# EAGLE board brains (EAGLE 5.11), part 1 of 3
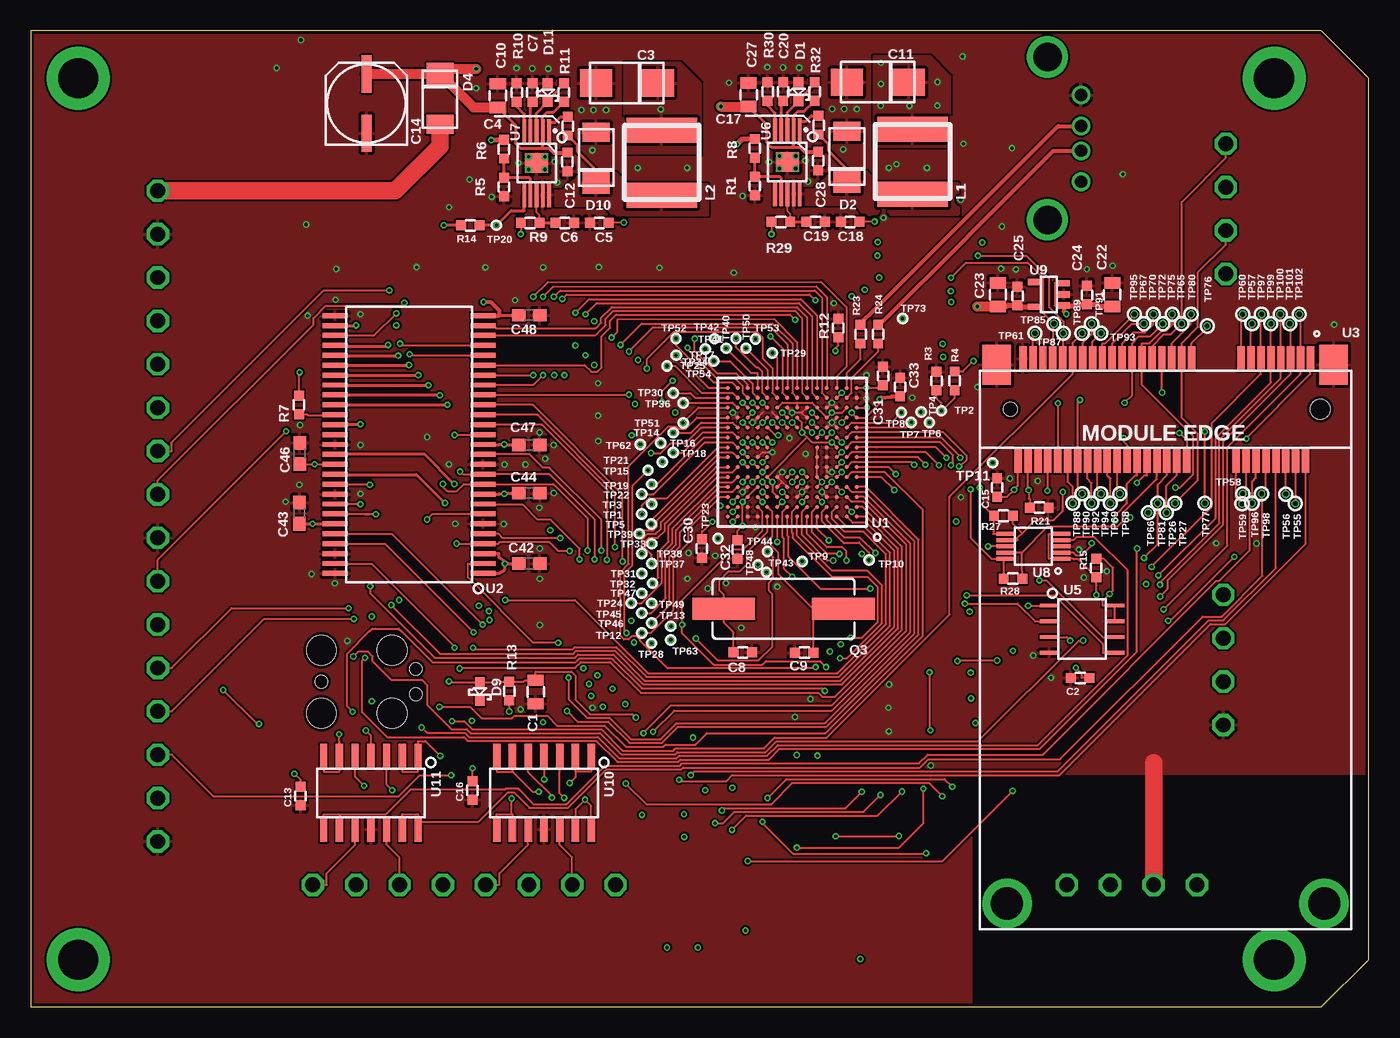
[diagram p6: board, top side]
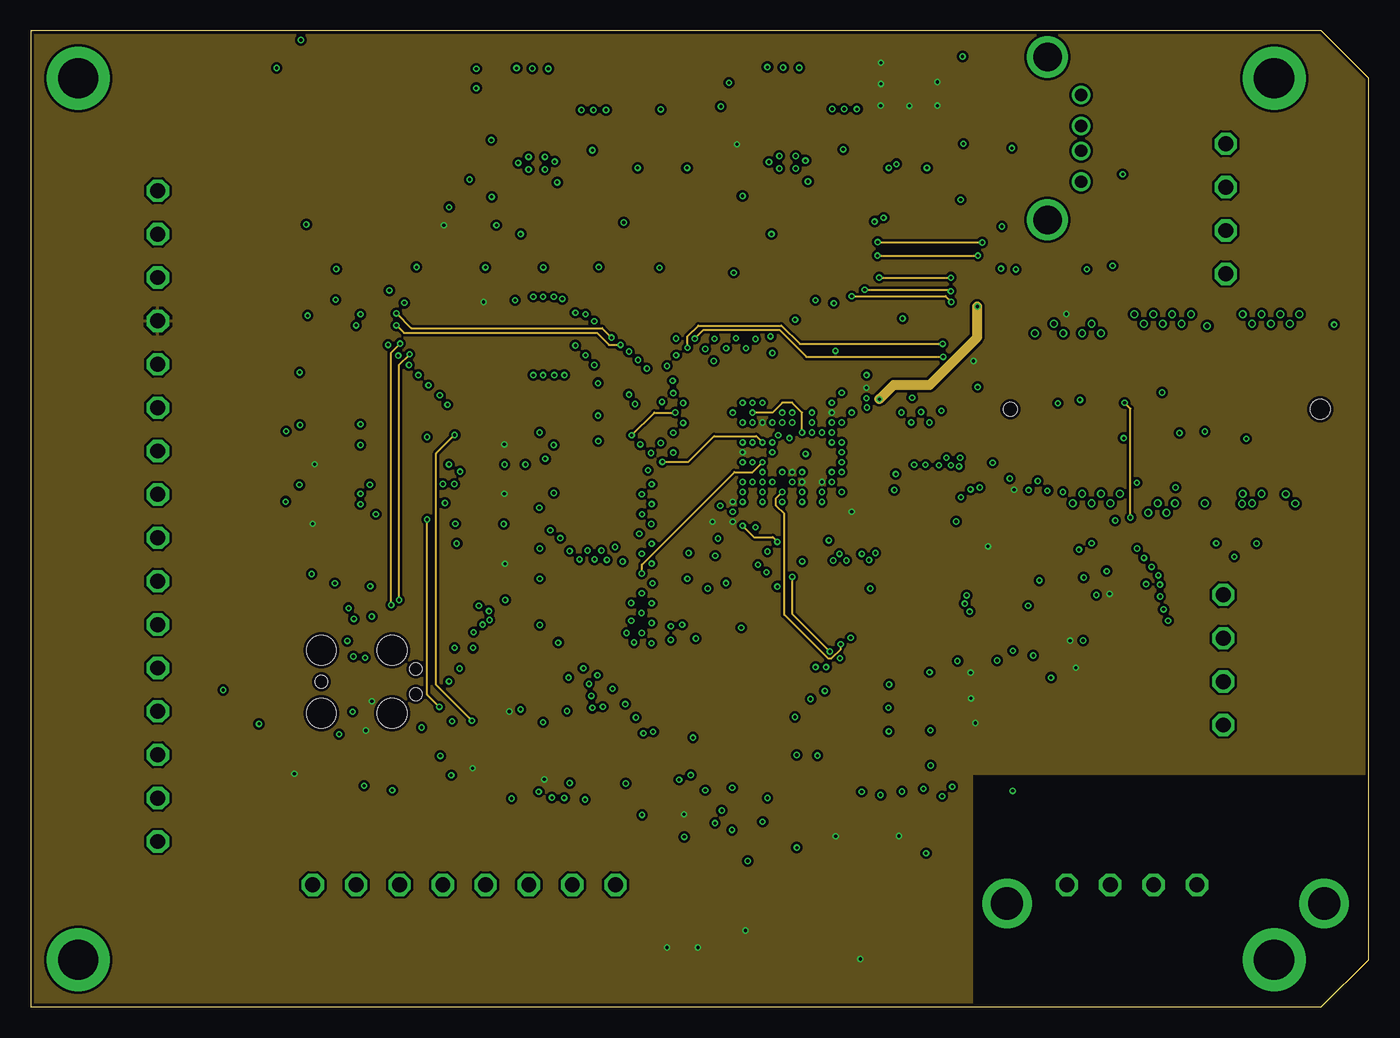
[diagram p7: board, inner layer Route2]
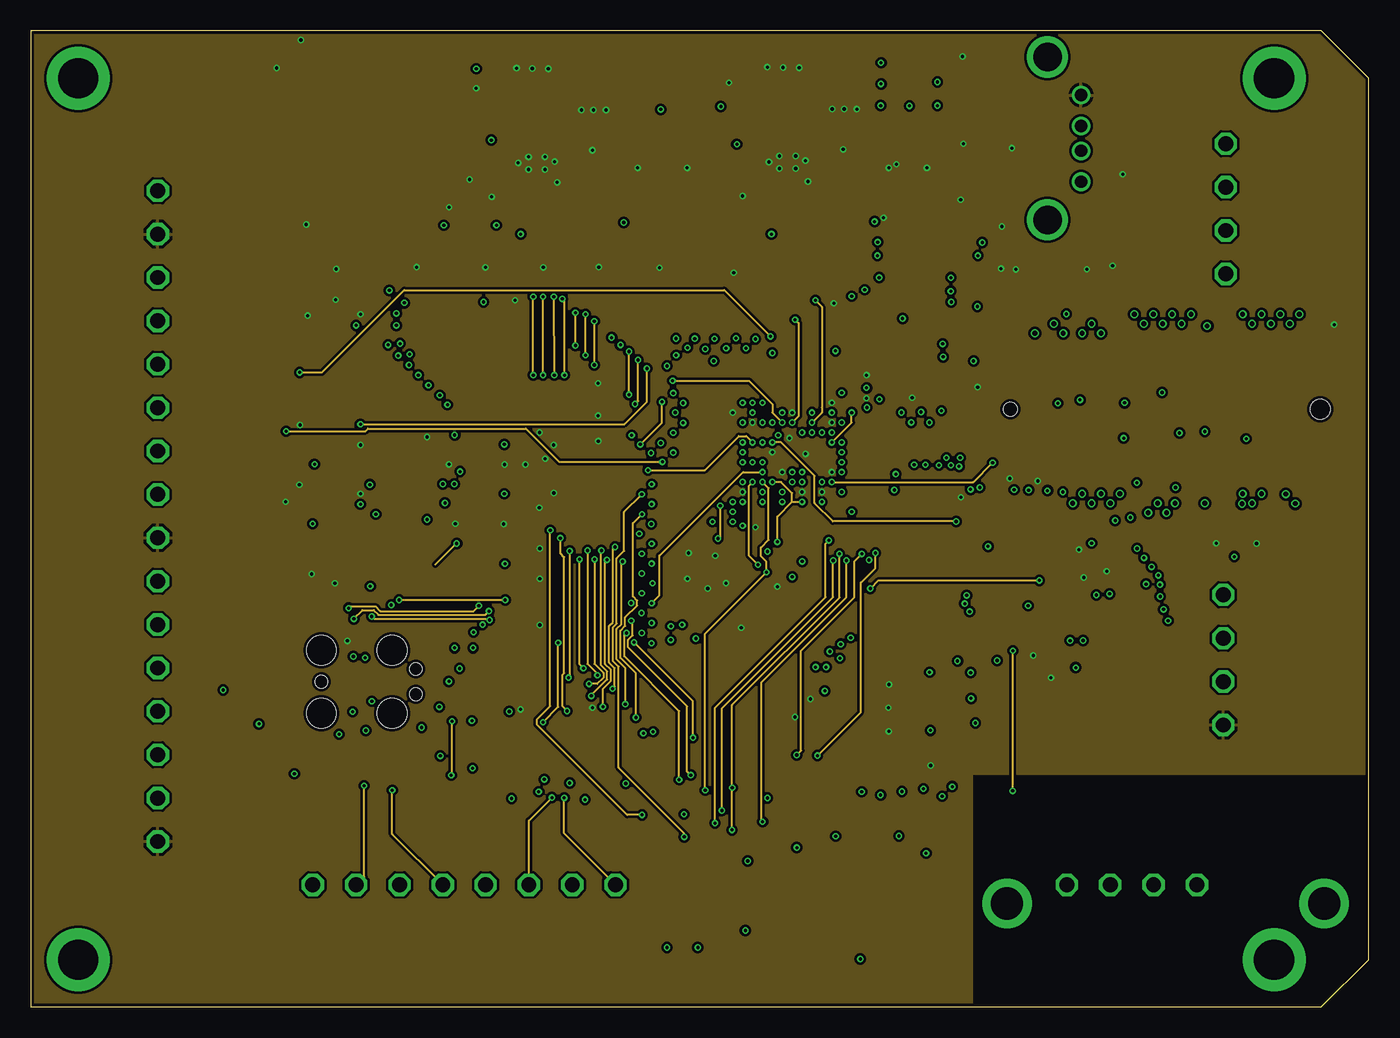
[diagram p8: board, inner layer Route3]
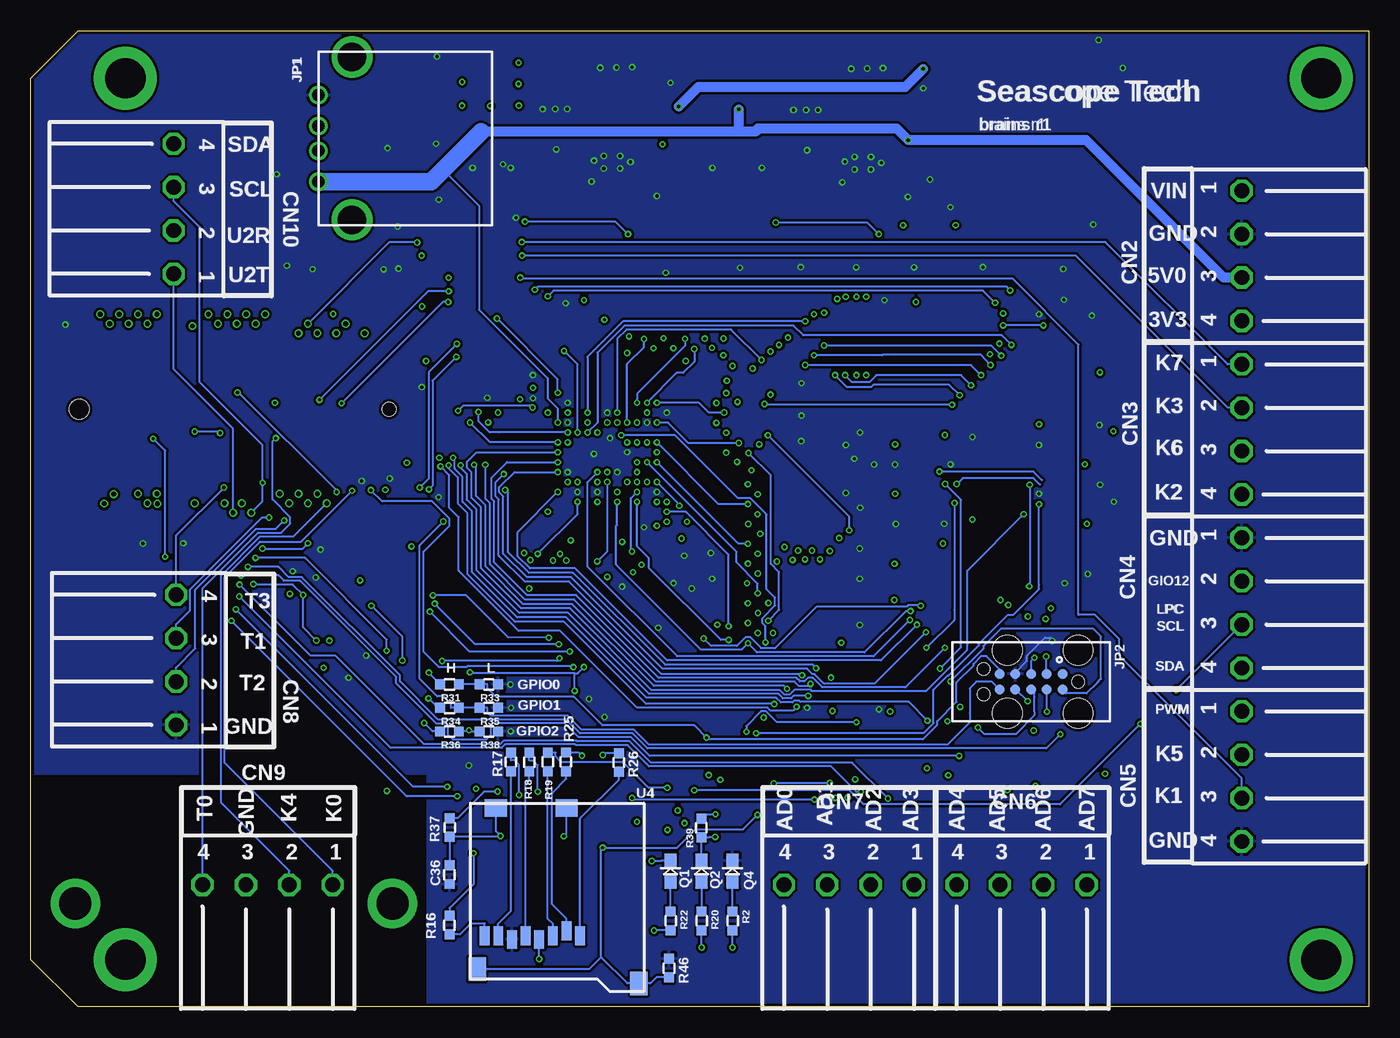
[diagram p9: board, bottom side, seen from below]

Size 107.95 x 78.74 mm. Coordinates in mm from the lower left corner, seen from the top.
Outline: 0,78.74 0,0
Copper layers (1+2*3+16): Top 0.0356mm / dielectric 0.2794mm / Route2 0.0356mm / dielectric 0.9906mm / Route3 0.0356mm / dielectric 0.2794mm / Bottom 0.0356mm
Design rules "66each-compact *": minimum track width 6mil, minimum drill 10mil, track to track 6mil, track to pad 6mil, pad to pad 6mil, via to via 6mil, smd to smd 6mil, copper to edge 10mil, drill to drill 10mil, minimum pad ring 5mil, minimum via ring 5mil, stop-mask expansion 2.5mil, vias tented up to drill 15mil, thermal gap 10mil
Net classes: 2 rf: clearance 0.635 mm; 3 usb: clearance 0.762 mm

## Footprints (pad centres in the part's own frame; a part is rotated, then mirrored left to right if it is on the bottom)
SMD0805 = smd 0.9 x 1.3: 1 -0.95,0; 2 0.95,0
SMD0603 = smd 0.8 x 0.8: 1 -0.75,0; 2 0.75,0
CT6032 = smd 2.6 x 2.2: + 2.5,0; - -2.5,0
PANASONIC-ELEC-D8 = smd 3 x 0.8: + 2.4,0; - -2.4,0
C0603 = smd 1.1 x 1: 1 -0.85,0; 2 0.85,0
1X4-3.5MM = drill 1.2 octagon: 1 0,0; 2 0,-3.5; 3 0,-7; 4 0,-10.5
0603-SCHOTTKY = smd 0.8 x 0.8: A -0.75,0; K 0.75,0
DO-214-AC(SMA) = smd 1.52 x 2.18: A 2.032,0 | smd 1.778 x 2.159: C -2.032,0
FORMFACTOR = drill 3.251 pad 5.08 round: S1 3.81,3.81; S2 100.33,3.81; S3 100.33,74.93; S4 3.81,74.93
UE27AC = drill 1 round: 1 -3.5,0; 2 -1,0; 3 1,0; 4 3.5,0 | drill 2.3 round: S1 -6.57,-2.71; S2 6.57,-2.71
TC2050-IDC = smd 0.8 x 0.8: 1 -2.54,-0.635; 2 -2.54,0.635; 3 -1.27,-0.635; 4 -1.27,0.635; 5 0,-0.635; 6 0,0.635; 7 1.27,-0.635; 8 1.27,0.635; 9 2.54,-0.635; 10 2.54,0.635 | hole 1: -3.81,0; 3.81,1.016; 3.81,-1.016 | hole 2.375: -3.81,2.54; -3.81,-2.54; 1.905,2.54; 1.905,-2.54
NR60 = smd 2 x 5.7: 1 -2.65,0; 2 2.6,0
LED0603 = smd 1.1 x 1: A -0.85,0; C 0.85,0
SM49 = smd 5.08 x 1.778: 1 -4.826,0; 2 4.826,0
10MIL = drill 0.254 pad 0.508 round: 1 0,0
15MIL = drill 0.381 round: 1 0,0
SOT570-3 = smd 0.31 x 0.31: A1 -5.2,5.2; A2 -4.4,5.2; A3 -3.6,5.2; A4 -2.8,5.2; A5 -2,5.2; A6 -1.2,5.2; A7 -0.4,5.2; A8 0.4,5.2; A9 1.2,5.2; A10 2,5.2; A11 2.8,5.2; A12 3.6,5.2; A13 4.4,5.2; A14 5.2,5.2; B1 -5.2,4.4; B2 -4.4,4.4; B3 -3.6,4.4; B4 -2.8,4.4; B5 -2,4.4; B6 -1.2,4.4; B7 -0.4,4.4; B8 0.4,4.4; B9 1.2,4.4; B10 2,4.4; B11 2.8,4.4; B12 3.6,4.4; B13 4.4,4.4; B14 5.2,4.4; C1 -5.2,3.6; C2 -4.4,3.6; C3 -3.6,3.6; C4 -2.8,3.6; C5 -2,3.6; C6 -1.2,3.6; C7 -0.4,3.6; C8 0.4,3.6; C9 1.2,3.6; C10 2,3.6; C11 2.8,3.6; C12 3.6,3.6; C13 4.4,3.6; C14 5.2,3.6; D1 -5.2,2.8; D2 -4.4,2.8; D3 -3.6,2.8; D4 -2.8,2.8; D5 -2,2.8; D6 -1.2,2.8; D7 -0.4,2.8; D8 0.4,2.8; D9 1.2,2.8; D10 2,2.8; D11 2.8,2.8; D12 3.6,2.8; D13 4.4,2.8; D14 5.2,2.8; E1 -5.2,2; E2 -4.4,2; E3 -3.6,2; E4 -2.8,2; E5 -2,2; E6 -1.2,2; E7 -0.4,2; E8 0.4,2; E9 1.2,2; E10 2,2; E11 2.8,2; E12 3.6,2; E13 4.4,2; E14 5.2,2; F1 -5.2,1.2; F2 -4.4,1.2; F3 -3.6,1.2; F4 -2.8,1.2; F5 -2,1.2; F10 2,1.2; F11 2.8,1.2; F12 3.6,1.2; F13 4.4,1.2; F14 5.2,1.2; G1 -5.2,0.4; G2 -4.4,0.4; G3 -3.6,0.4; G4 -2.8,0.4; G5 -2,0.4; G10 2,0.4; G11 2.8,0.4; G12 3.6,0.4; G13 4.4,0.4; G14 5.2,0.4; H1 -5.2,-0.4; H2 -4.4,-0.4; H3 -3.6,-0.4; H4 -2.8,-0.4; H5 -2,-0.4; H10 2,-0.4; H11 2.8,-0.4; H12 3.6,-0.4; H13 4.4,-0.4; H14 5.2,-0.4; J1 -5.2,-1.2; J2 -4.4,-1.2; J3 -3.6,-1.2; J4 -2.8,-1.2; J5 -2,-1.2; J10 2,-1.2; J11 2.8,-1.2; J12 3.6,-1.2; J13 4.4,-1.2; J14 5.2,-1.2; K1 -5.2,-2; K2 -4.4,-2; K3 -3.6,-2; K4 -2.8,-2; K5 -2,-2; K6 -1.2,-2; K7 -0.4,-2; K8 0.4,-2; K9 1.2,-2; K10 2,-2; K11 2.8,-2; K12 3.6,-2; K13 4.4,-2; K14 5.2,-2; L1 -5.2,-2.8; L2 -4.4,-2.8; L3 -3.6,-2.8; L4 -2.8,-2.8; L5 -2,-2.8; L6 -1.2,-2.8; L7 -0.4,-2.8; L8 0.4,-2.8; L9 1.2,-2.8; L10 2,-2.8; L11 2.8,-2.8; L12 3.6,-2.8; L13 4.4,-2.8; L14 5.2,-2.8; M1 -5.2,-3.6; M2 -4.4,-3.6; M3 -3.6,-3.6; M4 -2.8,-3.6; M5 -2,-3.6; M6 -1.2,-3.6; M7 -0.4,-3.6; M8 0.4,-3.6; M9 1.2,-3.6; M10 2,-3.6; M11 2.8,-3.6; M12 3.6,-3.6; M13 4.4,-3.6; M14 5.2,-3.6; N1 -5.2,-4.4; N2 -4.4,-4.4; N3 -3.6,-4.4; N4 -2.8,-4.4; N5 -2,-4.4; N6 -1.2,-4.4; N7 -0.4,-4.4; N8 0.4,-4.4; N9 1.2,-4.4; N10 2,-4.4; N11 2.8,-4.4; N12 3.6,-4.4; N13 4.4,-4.4; N14 5.2,-4.4; P1 -5.2,-5.2; P2 -4.4,-5.2; P3 -3.6,-5.2; P4 -2.8,-5.2; P5 -2,-5.2; P6 -1.2,-5.2; P7 -0.4,-5.2; P8 0.4,-5.2; P9 1.2,-5.2; P10 2,-5.2; P11 2.8,-5.2; P12 3.6,-5.2; P13 4.4,-5.2; P14 5.2,-5.2
TSSOP-54 = smd 2 x 0.4: 1 -5.98,10.4; 2 -5.98,9.6; 3 -5.98,8.8; 4 -5.98,8; 5 -5.98,7.2; 6 -5.98,6.4; 7 -5.98,5.6; 8 -5.98,4.8; 9 -5.98,4; 10 -5.98,3.2; 11 -5.98,2.4; 12 -5.98,1.6; 13 -5.98,0.8; 14 -5.98,0; 15 -5.98,-0.8; 16 -5.98,-1.6; 17 -5.98,-2.4; 18 -5.98,-3.2; 19 -5.98,-4; 20 -5.98,-4.8; 21 -5.98,-5.6; 22 -5.98,-6.4; 23 -5.98,-7.2; 24 -5.98,-8; 25 -5.98,-8.8; 26 -5.98,-9.6; 27 -5.98,-10.4; 28 5.98,-10.4; 29 5.98,-9.6; 30 5.98,-8.8; 31 5.98,-8; 32 5.98,-7.2; 33 5.98,-6.4; 34 5.98,-5.6; 35 5.98,-4.8; 36 5.98,-4; 37 5.98,-3.2; 38 5.98,-2.4; 39 5.98,-1.6; 40 5.98,-0.8; 41 5.98,0; 42 5.98,0.8; 43 5.98,1.6; 44 5.98,2.4; 45 5.98,3.2; 46 5.98,4; 47 5.98,4.8; 48 5.98,5.6; 49 5.98,6.4; 50 5.98,7.2; 51 5.98,8; 52 5.98,8.8; 53 5.98,9.6; 54 5.98,10.4
MINI-MODULE = smd 0.6 x 2: 1 -11.6,-4.1; 2 -11.2,4.1; 3 -10.8,-4.1; 4 -10.4,4.1; 5 -10,-4.1; 6 -9.6,4.1; 7 -9.2,-4.1; 8 -8.8,4.1; 9 -8.4,-4.1; 10 -8,4.1; 11 -7.6,-4.1; 12 -7.2,4.1; 13 -6.8,-4.1; 14 -6.4,4.1; 15 -6,-4.1; 16 -5.6,4.1; 17 -2,-4.1; 18 -1.6,4.1; 19 -1.2,-4.1; 20 -0.8,4.1; 21 -0.4,-4.1; 22 0,4.1; 23 0.4,-4.1; 24 0.8,4.1; 25 1.2,-4.1; 26 1.6,4.1; 27 2,-4.1; 28 2.4,4.1; 29 2.8,-4.1; 30 3.2,4.1; 31 3.6,-4.1; 32 4,4.1; 33 4.4,-4.1; 34 4.8,4.1; 35 5.2,-4.1; 36 5.6,4.1; 37 6,-4.1; 38 6.4,4.1; 39 6.8,-4.1; 40 7.2,4.1; 41 7.6,-4.1; 42 8,4.1; 43 8.4,-4.1; 44 8.8,4.1; 45 9.2,-4.1; 46 9.6,4.1; 47 10,-4.1; 48 10.4,4.1; 49 10.8,-4.1; 50 11.2,4.1; 51 11.6,-4.1; 52 12,4.1 | drill 2.6 pad 4 round: 53 -12.7,39.862; 54 12.9,39.862 | smd 2.3 x 3.2: S1 -13.473,-3.6; S2 13.727,-3.6 | hole 1.1: 12.627,0 | hole 1.6: -12.373,0
SD-MICRO-101-00581-59 = smd 0.8 x 1.5: 1 0,0; 2 1.1,-0.4; 3 2.2,0; 4 3.3,0.3; 5 4.4,0; 6 5.5,0.3; 7 6.6,0; 8 7.7,0 | smd 1.8 x 1.4: 10-1 1.1,-10.3; 10-2 6.8,-10.3 | smd 1.4 x 1.9: S1 8.3,2.7; S2 -4.75,3.85
M25-SO8 = smd 1.5 x 0.3: 1 -2.65,1.905; 2 -2.65,0.635; 3 -2.65,-0.635; 4 -2.65,-1.905; 5 2.65,-1.905; 6 2.65,-0.635; 7 2.65,0.635; 8 2.65,1.905
POWERPAD-10 = smd 2 x 0.3: 1 -2.55,1; 2 -2.55,0.5; 3 -2.55,0; 4 -2.55,-0.5; 5 -2.55,-1; 6 2.55,-1; 7 2.55,-0.5; 8 2.55,0; 9 2.55,0.5; 10 2.55,1 | smd 1.57 x 1.88: 11 0,0
MSOP-10 = smd 1.5 x 0.32: 1 -2.25,1; 2 -2.25,0.5; 3 -2.25,0; 4 -2.25,-0.5; 5 -2.25,-1; 6 2.25,-1; 7 2.25,-0.5; 8 2.25,0; 9 2.25,0.5; 10 2.25,1
SOT-23-5 = smd 0.5 x 1: 1 0.9,1.3; 2 0,1.3; 3 -0.9,1.3; 4 -1,-1.1; 5 1,-1.1
SOIC-14 = smd 2 x 0.6: 1 -2.95,3.81; 2 -2.95,2.54; 3 -2.95,1.27; 4 -2.95,0; 5 -2.95,-1.27; 6 -2.95,-2.54; 7 -2.95,-3.81; 8 2.95,-3.81; 9 2.95,-2.54; 10 2.95,-1.27; 11 2.95,0; 12 2.95,1.27; 13 2.95,2.54; 14 2.95,3.81

## Placement (x,y rotation side)
C1  [SMD0805]  40.74,25.41 90 top
C2  [SMD0603]  84.68,26.54 0 top
C3  [CT6032]  48.11,74.54 0 top
C4  [SMD0603]  43.32,71.06 270 top
C5  [SMD0603]  45.87,63.26 180 top
C6  [SMD0603]  43.08,63.26 180 top
C7  [SMD0603]  40.47,73.77 270 top
C8  [SMD0603]  57.45,28.62 180 top
C9  [SMD0603]  62.42,28.59 0 top
C10  [SMD0805]  37.68,73.52 270 top
C11  [CT6032]  68.35,74.61 0 top
C12  [SMD0603]  43.29,68.19 90 top
C13  [SMD0603]  21.77,17.02 90 top
C14  [PANASONIC-ELEC-D8]  27.08,72.88 90 top
C15  [SMD0603]  77.98,41.91 270 top
C16  [SMD0603]  35.64,17.48 90 top
C17  [SMD0603]  63.57,71.14 270 top
C18  [SMD0603]  66.12,63.34 180 top
C19  [SMD0603]  63.32,63.34 180 top
C20  [SMD0603]  60.71,73.85 270 top
C22  [SMD0805]  87.26,57.46 270 top
C23  [SMD0805]  78.04,57.46 270 top
C24  [SMD0603]  85.22,57.44 270 top
C25  [SMD0603]  79.61,57.36 270 top
C27  [SMD0805]  57.92,73.6 270 top
C28  [SMD0603]  63.53,68.26 90 top
C30  0.1u  [SMD0603]  54.16,36.99 90 top
C31  0.1u  [SMD0603]  68.76,50.91 270 top
C32  0.1u  [SMD0603]  57.04,36.91 90 top
C33  0.1u  [SMD0603]  70.15,50.01 270 top
C36  0.1u  [SMD0603]  74.17,10.67 90 bottom
C42  0.1u  [C0603]  40.21,35.78 0 top
C43  0.1u  [C0603]  21.67,39.84 90 top
C44  0.1u  [C0603]  40.22,41.45 0 top
C46  0.1u  [C0603]  21.69,44.65 90 top
C47  0.1u  [C0603]  40.21,45.34 0 top
C48  0.1u  [C0603]  40.21,55.8 0 top
CN2  CONN-4  [1X4-3.5MM]  10.24,65.85 0 bottom
CN3  CONN-4  [1X4-3.5MM]  10.24,51.85 0 bottom
CN4  CONN-4  [1X4-3.5MM]  10.24,37.85 0 bottom
CN5  CONN-4  [1X4-3.5MM]  10.24,23.85 0 bottom
CN6  CONN-4  [1X4-3.5MM]  22.74,9.85 270 bottom
CN7  CONN-4  [1X4-3.5MM]  36.68,9.85 270 bottom
CN8  CONN-4  [1X4-3.5MM]  96.24,22.75 180 bottom
CN9  CONN-4  [1X4-3.5MM]  83.6,9.85 270 bottom
CN10  CONN-4  [1X4-3.5MM]  96.44,59.14 180 bottom
D1  [0603-SCHOTTKY]  61.95,73.84 270 top
D2  [DO-214-AC(SMA)]  65.86,68.61 90 top
D4  [DO-214-AC(SMA)]  33.01,73.24 270 top
D9  [0603-SCHOTTKY]  36.22,25.46 270 top
D10  [DO-214-AC(SMA)]  45.61,68.54 90 top
D11  [0603-SCHOTTKY]  41.71,73.76 270 top
FF1  FORMFACTOR  [FORMFACTOR]  0,0 0 top
JP1  USB-CONN  [UE27AC]  84.75,70.07 90 bottom
JP2  1X10-TC2050  [TC2050-IDC]  27.24,26.24 180 bottom
L1  [NR60]  71.15,68.21 90 top
L2  [NR60]  50.91,68.14 90 top
Q1  [LED0603]  56.34,10.95 90 bottom
Q2  [LED0603]  53.84,10.95 90 bottom
Q3  [SM49]  60.74,32.13 180 top
Q4  [LED0603]  51.34,10.95 90 bottom
R1  [SMD0603]  58.43,66.23 90 top
R2  [SMD0603]  51.34,6.95 270 bottom
R3  [SMD0603]  73.08,50.5 270 top
R4  [SMD0603]  74.55,50.52 90 top
R5  [SMD0603]  38.18,66.15 90 top
R6  [SMD0603]  38.18,69.2 90 top
R7  33  [SMD0603]  21.64,48.58 90 top
R8  [SMD0603]  58.43,69.28 90 top
R9  [SMD0603]  40.28,63.26 0 top
R10  [SMD0603]  39.2,73.77 270 top
R11  [SMD0603]  43.01,73.77 270 top
R12  [SMD0603]  65.16,54.78 270 top
R13  [SMD0603]  38.6,25.48 270 top
R14  [SMD0603]  35.46,63.07 180 top
R15  [SMD0603]  85.98,35.41 90 top
R16  [SMD0603]  74.17,6.6 90 bottom
R17  [SMD0603]  69.21,19.76 90 bottom
R18  [SMD0603]  67.73,19.75 90 bottom
R19  [SMD0603]  66.24,19.77 90 bottom
R20  [SMD0603]  53.84,6.95 270 bottom
R21  [SMD0603]  81.38,40.28 180 top
R22  [SMD0603]  56.34,6.95 270 bottom
R23  [SMD0603]  66.95,54.28 270 top
R24  [SMD0603]  68.38,54.28 270 top
R25  [SMD0603]  64.76,19.78 90 bottom
R26  [SMD0603]  60.5,19.72 90 bottom
R27  [SMD0603]  78.49,39.62 0 top
R28  [SMD0603]  79.25,34.54 0 top
R29  [SMD0603]  60.53,63.34 0 top
R30  [SMD0603]  59.44,73.85 270 top
R31  [SMD0603]  74.17,26.04 180 bottom
R32  [SMD0603]  63.25,73.85 270 top
R33  [SMD0603]  70.99,26.04 180 bottom
R34  [SMD0603]  74.17,24.13 180 bottom
R35  [SMD0603]  70.99,24.13 180 bottom
R36  [SMD0603]  74.17,22.23 180 bottom
R37  [SMD0603]  74.17,14.48 270 bottom
R38  [SMD0603]  70.99,22.23 180 bottom
R39  [SMD0603]  53.84,14.45 90 bottom
R46  [SMD0603]  56.46,3.14 270 bottom
TP1  TP-10MIL  [10MIL]  49.31,39.76 180 top
TP2  TP-10MIL  [10MIL]  73.48,48.11 0 top
TP3  TP-10MIL  [10MIL]  50.1,40.57 180 top
TP4  TP-10MIL  [10MIL]  71.84,48 180 top
TP5  TP-10MIL  [10MIL]  50.06,38.96 180 top
TP6  TP-10MIL  [10MIL]  72.51,47.15 180 top
TP7  TP-10MIL  [10MIL]  71.05,47.16 180 top
TP8  TP-10MIL  [10MIL]  70.25,47.96 180 top
TP9  TP-10MIL  [10MIL]  62.24,35.95 180 top
TP10  TP-10MIL  [10MIL]  67.64,36.06 180 top
TP11  TP-10MIL  [10MIL]  77.61,43.9 180 top
TP12  TP-10MIL  [10MIL]  49.3,30.17 180 top
TP13  TP-10MIL  [10MIL]  51.65,30.72 180 top
TP14  TP-10MIL  [10MIL]  51.84,46.32 180 top
TP15  TP-10MIL  [10MIL]  49.8,43.3 180 top
TP16  TP-10MIL  [10MIL]  50.83,45.5 180 top
TP17  TP-10MIL  [10MIL]  52.07,52.58 0 top
TP18  TP-10MIL  [10MIL]  51.84,44.72 180 top
TP19  TP-10MIL  [10MIL]  50.1,42.17 180 top
TP20  TP-10MIL  [10MIL]  37.57,63.07 0 top
TP21  TP-10MIL  [10MIL]  50.96,43.97 180 top
TP22  TP-10MIL  [10MIL]  49.3,41.37 180 top
TP23  TP-10MIL  [10MIL]  55.45,37.8 0 top
TP24  TP-10MIL  [10MIL]  48.44,32.59 0 top
TP25  TP-10MIL  [10MIL]  51.33,51.71 0 top
TP26  TP  [15MIL]  91.64,39.88 0 top
TP27  TP  [15MIL]  92.33,40.64 0 top
TP28  TP-10MIL  [10MIL]  50.09,29.34 0 top
TP29  TP-10MIL  [10MIL]  59.84,52.76 180 top
TP30  TP-10MIL  [10MIL]  51.84,49.52 180 top
TP31  TP-10MIL  [10MIL]  49.3,34.97 180 top
TP32  TP-10MIL  [10MIL]  50.16,34.18 180 top
TP33  TP-10MIL  [10MIL]  50.1,37.37 180 top
TP34  TP-10MIL  [10MIL]  54.41,53.08 180 top
TP36  TP-10MIL  [10MIL]  52.64,48.72 180 top
TP37  TP-10MIL  [10MIL]  50.1,35.77 180 top
TP38  TP-10MIL  [10MIL]  49.3,36.57 180 top
TP39  TP-10MIL  [10MIL]  49.09,38.17 180 top
TP40  TP-10MIL  [10MIL]  56.1,53.14 180 top
TP41  TP-10MIL  [10MIL]  56.9,53.94 180 top
TP42  TP-10MIL  [10MIL]  55.16,53.91 180 top
TP43  TP-10MIL  [10MIL]  59.36,35.07 180 top
TP44  TP-10MIL  [10MIL]  59.44,36.75 180 top
TP45  TP-10MIL  [10MIL]  49.28,31.78 180 top
TP46  TP-10MIL  [10MIL]  50.1,30.97 180 top
TP47  TP-10MIL  [10MIL]  49.3,33.37 180 top
TP48  TP-10MIL  [10MIL]  58.68,35.67 180 top
TP49  TP-10MIL  [10MIL]  50.1,32.57 180 top
TP50  TP-10MIL  [10MIL]  57.7,53.14 180 top
TP51  TP-10MIL  [10MIL]  52.64,47.12 180 top
TP52  TP-10MIL  [10MIL]  52.06,53.93 180 top
TP53  TP-10MIL  [10MIL]  58.48,53.89 180 top
TP54  TP-10MIL  [10MIL]  55.1,52.11 180 top
TP55  TP  [15MIL]  102.03,40.61 180 top
TP56  TP  [15MIL]  101.27,41.38 180 top
TP57  TP  [15MIL]  98.55,55.12 180 top
TP58  TP  [15MIL]  97.79,41.4 180 top
TP59  TP  [15MIL]  97.74,40.59 180 top
TP60  TP  [15MIL]  97.79,55.88 180 top
TP61  TP  [15MIL]  81.03,54.36 180 top
TP62  TP-10MIL  [10MIL]  49.17,45.39 0 top
TP63  TP-10MIL  [10MIL]  51.64,29.62 0 top
TP65  TP  [15MIL]  92.86,55.12 180 top
TP66  TP  [15MIL]  90.17,39.88 180 top
TP67  TP  [15MIL]  89.81,55.12 180 top
TP68  TP  [15MIL]  87.88,41.4 180 top
TP69  TP  [15MIL]  87.12,40.64 180 top
TP70  TP  [15MIL]  90.58,55.88 180 top
TP72  TP  [15MIL]  91.34,55.12 180 top
TP73  TP-10MIL  [10MIL]  70.35,55.55 0 top
TP75  TP  [15MIL]  92.1,55.88 180 top
TP76  TP  [15MIL]  94.92,54.94 180 top
TP77  TP  [15MIL]  94.74,40.64 180 top
TP80  TP  [15MIL]  93.62,55.88 180 top
TP81  TP  [15MIL]  90.93,40.64 180 top
TP85  TP  [15MIL]  82.55,55.12 180 top
TP87  TP  [15MIL]  83.31,54.36 180 top
TP88  TP  [15MIL]  84.07,40.64 180 top
TP89  TP  [15MIL]  84.84,54.36 180 top
TP90  TP  [15MIL]  84.84,41.4 180 top
TP91  TP  [15MIL]  85.6,55.12 180 top
TP92  TP  [15MIL]  85.6,40.64 180 top
TP93  TP  [15MIL]  86.36,54.36 180 top
TP94  TP  [15MIL]  86.36,41.4 180 top
TP95  TP  [15MIL]  89.05,55.88 180 top
TP96  TP  [15MIL]  98.55,40.64 180 top
TP97  TP  [15MIL]  99.31,55.88 180 top
TP98  TP  [15MIL]  99.31,41.4 180 top
TP99  TP  [15MIL]  100.08,55.12 180 top
TP100  TP  [15MIL]  100.84,55.88 180 top
TP101  TP  [15MIL]  101.6,55.12 180 top
TP102  TP  [15MIL]  102.36,55.88 180 top
U1  LPC3130  [SOT570-3]  61.44,44.75 180 top
U2  MT48LC8M16A2  [TSSOP-54]  30.52,45.38 180 top
U3  MINI-MOD  [MINI-MODULE]  91.67,48.21 180 top
U4  MICRO-SD-CARD-AMP-1010058159  [SD-MICRO-101-00581-59]  63.63,5.75 180 bottom
U5  M25P10-AVMN  [M25-SO8]  84.84,30.48 0 top
U6  TPS54140  [POWERPAD-10]  61.05,68.16 270 top
U7  TPS54140  [POWERPAD-10]  40.81,68.09 270 top
U8  TS5A23159  [MSOP-10]  80.9,37.16 180 top
U9  NCP571SN12-BM5  [SOT-23-5]  82.05,57.49 270 top
U10  OPA4330  [SOIC-14]  41.4,17.27 270 top
U11  OPA4330  [SOIC-14]  27.43,17.27 270 top